# EAGLE design dBreathe (EAGLE 6.3)
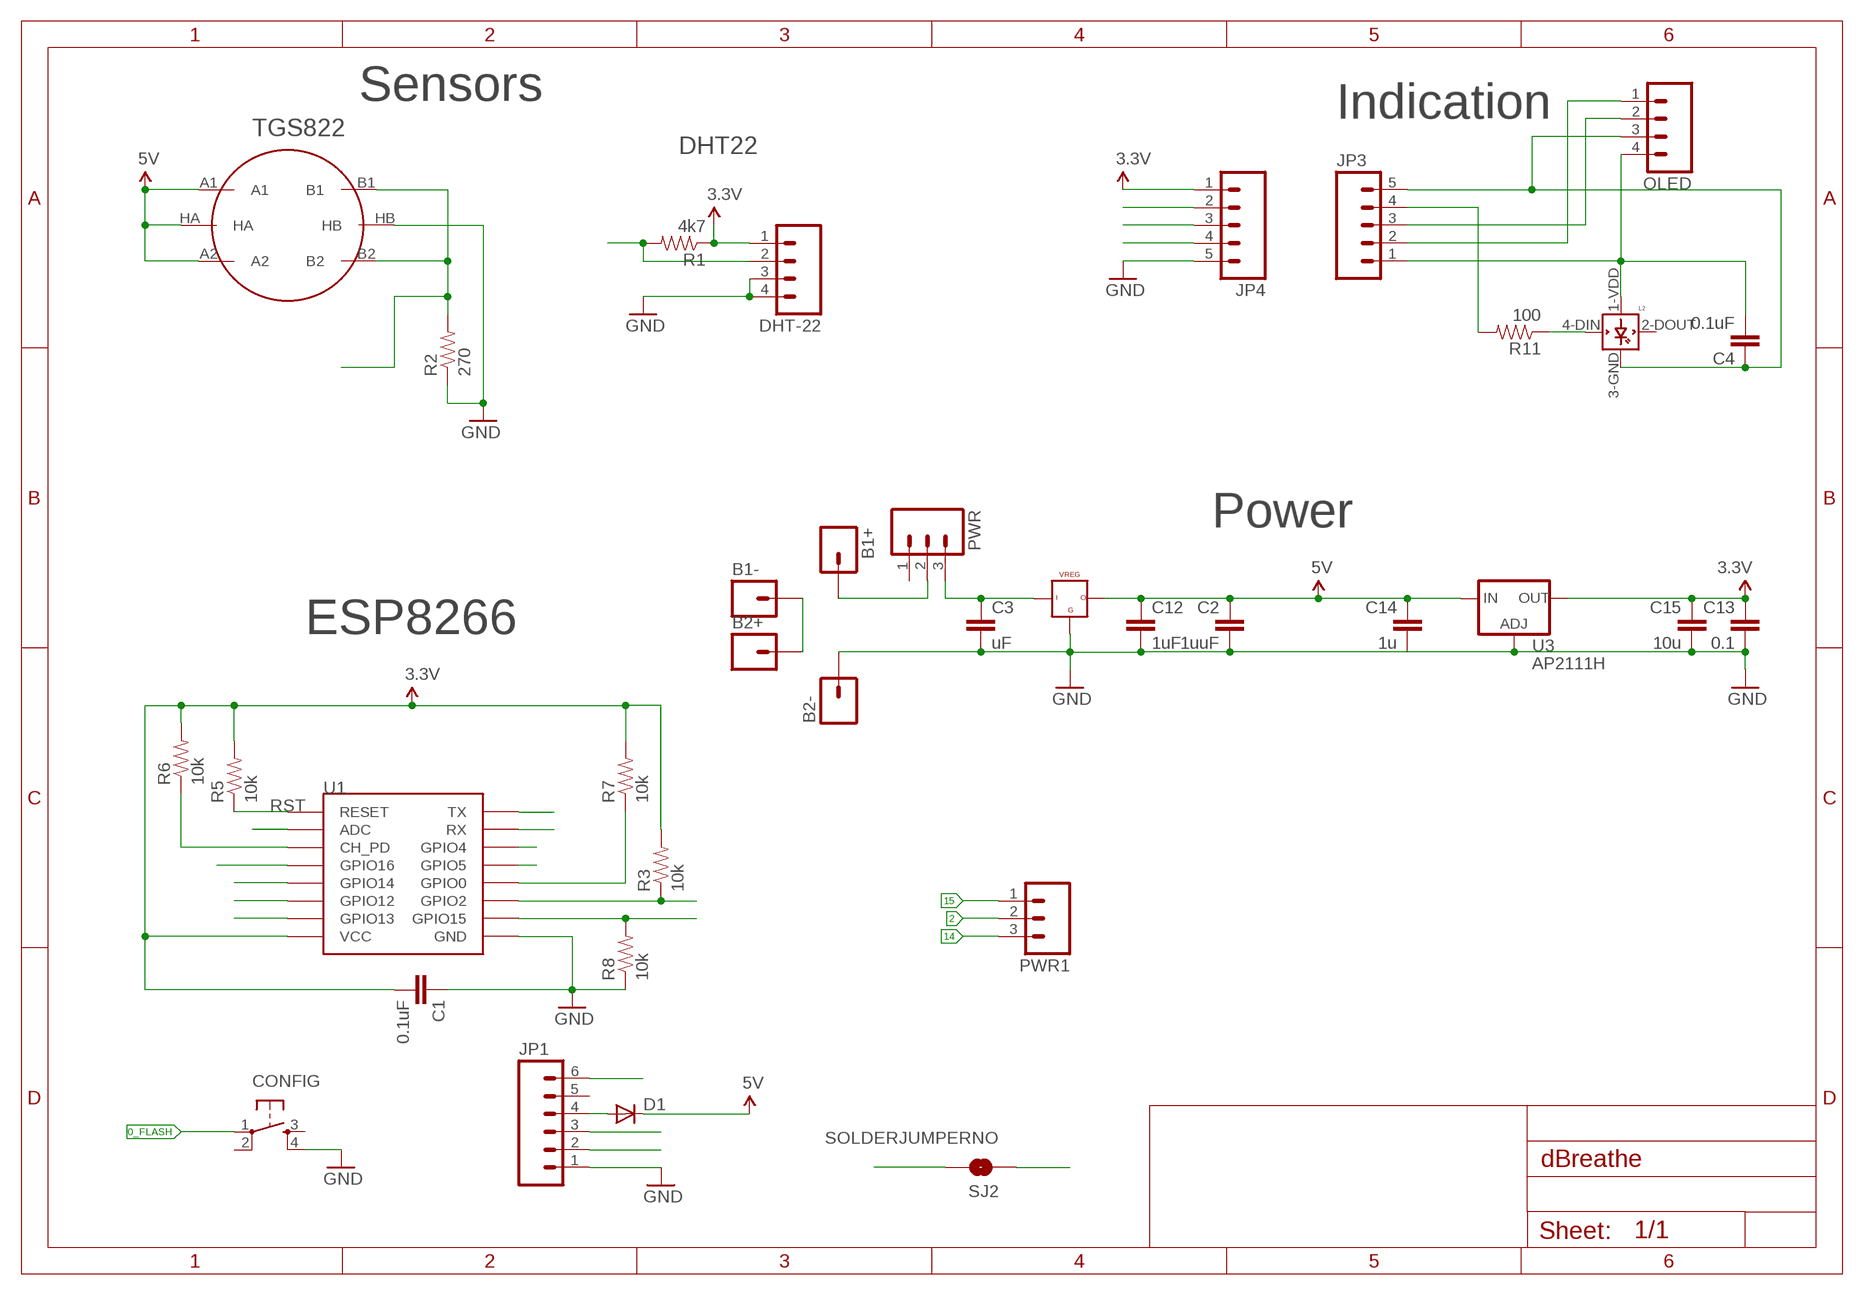
[diagram p0: schematic, sheet 1]

## Parts
B1+  M01PTH  [1X01]
B1-  M01PTH  [1X01]
B2+  M01PTH  [1X01]
B2-  M01PTH  [1X01]
C1  0.1uF  CAP0805  [0805]
C2  1uuF  CAP0805  [0805]
C3  uF  CAP0805  [0805]
C4  0.1uF  CAP0805  [0805]
C12  1uF  CAP0805  [0805]
C13  0.1  CAP0805  [0805]
C14  1u  CAP0805  [0805]
C15  10u  CAP0805-CAP  [0805-CAP]
CONFIG  TAC_SWITCHSMD  [TACTILE_SWITCH_SMD]
D1  DIODESOD  [SOD-323]
DHT-22  M04PTH  [1X04]
JP1  M06NO_SILK_FEMALE_PTH  [1X06_NO_SILK]
JP3  M05PTH  [1X05]
JP4  M05PTH  [1X05]
L2  WS2812B  [WS2812B]
OLED  M041X04_NO_SILK  [1X04_NO_SILK]
PWR  M03PTH  [1X03]
PWR1  M03PTH  [1X03]
R1  4k7  RESISTOR0805-RES  [0805]
R2  270  RESISTOR0805  [0805]
R3  10k  RESISTOR0805  [0805]
R5  10k  RESISTOR0805  [0805]
R6  10k  RESISTOR0805  [0805]
R7  10k  RESISTOR0805  [0805]
R8  10k  RESISTOR0805  [0805]
R11  100  RESISTOR0805  [0805]
SJ2  SOLDERJUMPERNO  [SJ_2S-NO]
U1  ESP12SMD  [ESP12-SMD]
U3  AP2111H  V_REG_317SMD  [SOT223]
U$4  VREG_5V  [DPACK]
U$7  METHANE_SENSOR  [MQ-3]

## Nets
0_FLASH: CONFIG.1 JP1.6 R7.1 U1.GPIO0
2: PWR1.2 R3.1 U1.GPIO2
3.3V: C1.2 C13.1 C15.1 DHT-22.1 JP4.1 R1.1 R3.2 R5.2 R6.2 R7.2 U1.VCC U3.2(OUT)
3V3_1: C4.2 JP3.1 L2.1-VDD(VDD) OLED.4
4_SDA: JP4.2 U1.GPIO5
4_SDA_1: JP3.2 OLED.1
5_SCL: JP4.3 U1.GPIO4
5_SCL_1: JP3.3 OLED.2
5V: C2.1 C12.1 C14.1 D1.1(C) U3.3(IN) U$4.3 U$7.A1 U$7.A2 U$7.HA
12_WS2812: JP4.4 U1.GPIO12
12_WS2812_1: JP3.4 R11.2
13_DHT: DHT-22.2 R1.2 U1.GPIO13
14: PWR1.3 U1.GPIO14
15: PWR1.1 R8.2 U1.GPIO15
16_DSLEEP: SJ2.2 U1.GPIO16
ADC: R2.2 U1.ADC U$7.B1 U$7.B2
CH_PD: R6.1 U1.CH_PD
GND: B2-.1 C1.1 C2.2 C3.2 C12.2 C13.2 C14.2 C15.2 CONFIG.4 DHT-22.3 DHT-22.4 JP1.1 JP4.5 R2.1 R8.1 U1.GND U3.1(ADJ) U$4.2 U$7.HB
GND_1: C4.1 JP3.5 L2.3-GND(GND) OLED.3
N$1: D1.2(A) JP1.4
N$2: B1+.1 PWR.2
N$5: L2.4-DIN(DIN) R11.1
N$6: B1-.1 B2+.1
RST: R5.1 SJ2.1 U1.RESET
RX: JP1.2 U1.TXD0(TX)
TX: JP1.3 U1.RXD0(RX)
VCC: C3.1 PWR.3 U$4.1
Unconnected: CONFIG.2 CONFIG.3 JP1.5 L2.2-DOUT(DOUT) PWR.1

## Notes on the sheet
- Sensors
- Indication
- TGS822
- DHT22
- Power
- ESP8266

## Library data of the parts
B1+ B1- B2+ B2- = SparkFun-Connectors:M01: Header 1 Standard 1-pin 0.1" header. Use with straight break away headers (SKU : PRT-00116), right angle break away headers (PRT-00553), swiss pins (PRT-00743), machine pins (PRT-00117), and female headers (PRT-00115).
C1 C3 C4 C12 = SparkFun-Capacitors:CAP: Capacitor Standard 0603 ceramic capacitor, and 0.1" leaded capacitor.
C2 C13-C15 = LowPowerLab:CAP: Capacitor Standard 0603 ceramic capacitor, and 0.1" leaded capacitor.
CONFIG = SparkFun-Electromechanical:TAC_SWITCH: Momentary Switch Button commonly used for reset or general input. Spark Fun Electronics SKU : COM-00097 SMT- SWCH-08247; PROD_ID: SWCH-08247
D1 = SparkFun-DiscreteSemi:DIODE: Diode These are standard reverse protection diodes and small signal diodes. SMA package can handle up to about 1A. SOD-323 can handle about 200mA. What the SOD-323 package when ordering, there are some mfgs out there that are 5-pin packages.
DHT-22 OLED = SparkFun-Connectors:M04: Header 4 Standard 4-pin 0.1" header. Use with straight break away headers (SKU : PRT-00116), right angle break away headers (PRT-00553), swiss pins (PRT-00743), machine pins (PRT-00117), and female headers (PRT-00115). Molex polarized connector foot print use with SKU : PRT-08231 with associated crimp pins and housings. 1MM SMD Version SKU: PRT-10208
JP1 = SparkFun-Connectors:M06: Header 6 Standard 6-pin 0.1" header. Use with straight break away headers (SKU : PRT-00116), right angle break away headers (PRT-00553), swiss pins (PRT-00743), machine pins (PRT-00117), and female headers (PRT-00115). Molex polarized connector foot print use with SKU : PRT-08094 with associated crimp pins and housings. NOTES ON THE VARIANTS LOCK and LOCK_LONGPADS... This footprint was designed to help hold the alignment of a through-hole component (i.e. 6-pin header) while soldering it into place. You may notice that each hole has been shifted either up or down by 0.005 of an inch from it's more standard position (which is a perfectly straight line). This slight alteration caused the pins (the squares in the middle) to touch the edges of the holes. Because they are alternating, it causes a "brace" to hold the component in place. 0.005 has proven to be the perfect amount of "off-center" position when using our standard breakaway headers. Although looks a little odd when you look at the bare footprint, once you have a header in there, the alteration is very hard to notice. Also,if you push a header all the way into place, it is covered up entirely on the bottom side. This idea of altering the position of holes to aid alignment will be further integrated into the Sparkfun Library for other footprints. It can help hold any component with 3 or more connection pins.; PROD_ID: CONN-08437
JP3 JP4 = SparkFun-Connectors:M05: Header 5 Standard 5-pin 0.1" header. Use with straight break away headers (SKU : PRT-00116), right angle break away headers (PRT-00553), swiss pins (PRT-00743), machine pins (PRT-00117), and female headers (PRT-00115). Molex polarized connector foot print use with SKU : PRT-08230 with associated crimp pins and housings.
L2 = adafruit:WS2812B
PWR PWR1 = SparkFun-Connectors:M03: Header 3 Standard 3-pin 0.1" header. Use with straight break away headers (SKU : PRT-00116), right angle break away headers (PRT-00553), swiss pins (PRT-00743), machine pins (PRT-00117), and female headers (PRT-00115). Molex polarized connector foot print use with SKU : PRT-08232 with associated crimp pins and housings.
R1 = SparkFun-Resistors:RESISTOR: Resistor Basic schematic elements and footprints for 0603, 1206, and PTH resistors.
R2 R3 R5-R8 R11 = LowPowerLab:RESISTOR: Resistor Basic schematic elements and footprints for 0603, 1206, and PTH resistors.
SJ2 = SparkFun-Passives:SOLDERJUMPER: Solder Jumper Standard SMD solder jumper. Used to automate production. Two varients : Normally Open and Normally Closed are the same, but have different paste layers. NC will have a large amount of paste and should jumper during reflow.
U1 = esp8266modules:ESP12: ESP8266 Wifi module 12
U3 = 11xSKIPS:V_REG_317: Voltage Regulator AP2111 3v3 Regulator SOT223 600mA
U$4 = 11xSKIPS:VREG_5V
U$7 = SparkFun-Sensors:METHANE_SENSOR: MQ-4 Methane Gas Sensor SEN-09404

## Net classes
1 power: width 0.381 mm, clearance 0.254 mm

## Board
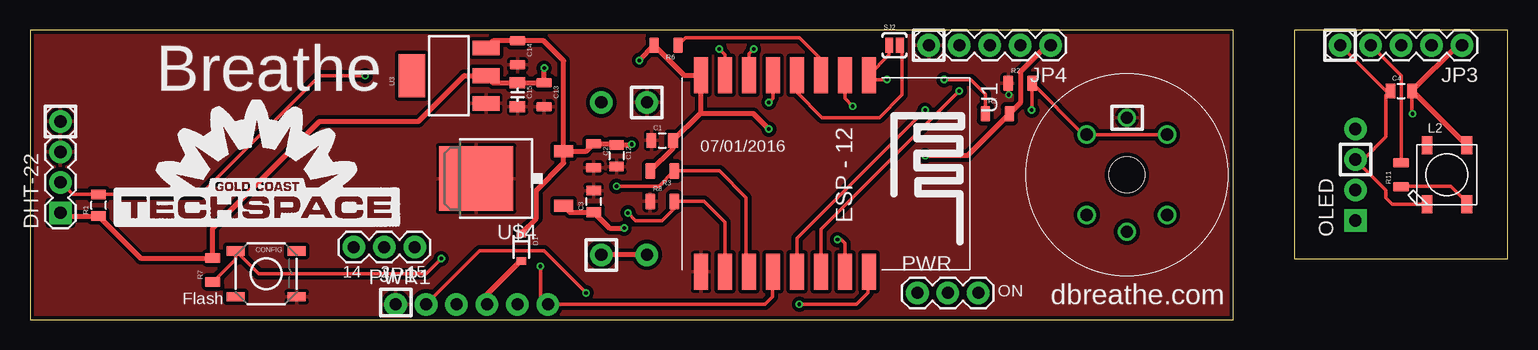
[diagram p1: board, top side]
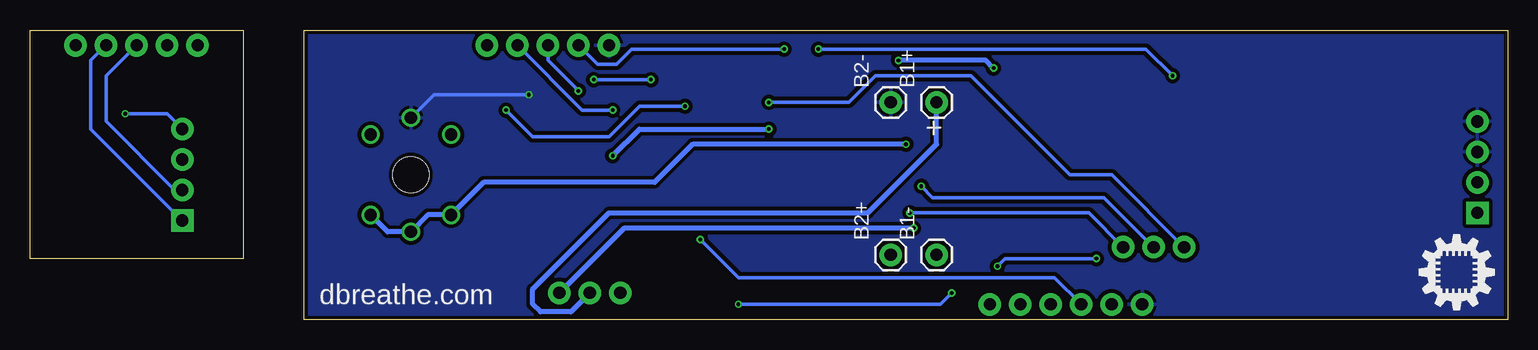
[diagram p2: board, bottom side, seen from below]

Size 123.19 x 24.13 mm. Coordinates in mm from the lower left corner, seen from the top.
Outline: 0,0 100.33,0 100.33,24.13 0,24.13 0,0
Outline: 105.41,24.13 105.41,5.08 123.19,5.08 123.19,24.13 105.41,24.13
Copper layers (1*16): Top 0.035mm / dielectric 1.5mm / Bottom 0.035mm
Design rules "dirt_cheap_dirty_boards.v1": minimum track width 5mil, minimum drill 12mil, track to track 5mil, track to pad 5mil, pad to pad 5mil, via to via 5mil, smd to smd 0mil, copper to edge 10mil, drill to drill 10mil, minimum pad ring 10mil, minimum via ring 6mil, stop-mask expansion 2mil, vias tented up to drill 25mil, thermal gap 10mil

### Footprints (pad centres in the part's own frame; a part is rotated, then mirrored left to right if it is on the bottom)
1X01 = drill 1.016 pad 1.88: 1 0,0
0805 = smd 0.8 x 1.2: 1 -0.9,0; 2 0.9,0
0805' = smd 0.8 x 1.3: 1 -1,0; 2 1,0
0805-CAP = smd 0.902 x 1.3: 1 -1,0; 2 1,0
TACTILE_SWITCH_SMD = smd 1.524 x 0.762: 1 -2.54,1.905; 2 2.54,1.905; 3 -2.54,-1.905; 4 2.54,-1.905
SOD-323 = smd 0.63 x 0.83: 1 -1.15,0; 2 1.15,0
1X04 = drill 1.016 pad 1.88 square: 1 0,0 | drill 1.016 pad 1.88: 2 2.54,0; 3 5.08,0; 4 7.62,0
1X06_NO_SILK = drill 1.016 pad 1.88: 1 0,0; 2 2.54,0; 3 5.08,0; 4 7.62,0; 5 10.16,0; 6 12.7,0
1X05 = drill 1.016 pad 1.88: 1 0,0; 2 2.54,0; 3 5.08,0; 4 7.62,0; 5 10.16,0
WS2812B = smd 1.5 x 0.9: 1-VDD 2.45,-1.65; 2-DOUT 2.45,1.65; 3-GND -2.45,1.65; 4-DIN -2.45,-1.65
1X04_NO_SILK = drill 1.016 pad 1.88 square: 1 0,0 | drill 1.016 pad 1.88: 2 2.54,0; 3 5.08,0; 4 7.62,0
1X03 = drill 1.016 pad 1.88: 1 0,0; 2 2.54,0; 3 5.08,0
SJ_2S-NO = smd 0.635 x 1.27: 1 -0.45,0; 2 0.45,0
ESP12-SMD = smd 3 x 1.2: ADC -8.3,3.8; CH_PD -8.3,1.8; GND 8.1,-8.2; GPIO0 8.1,-2.2; GPIO2 8.1,-4.2; GPIO4 8.1,1.8; GPIO5 8.1,-0.2; GPIO12 -8.3,-4.2; GPIO13 -8.3,-6.2; GPIO14 -8.3,-2.2; GPIO15 8.1,-6.2; GPIO16 -8.3,-0.2; RESET -8.3,5.8; RXD0 8.1,3.8; TXD0 8.1,5.8; VCC -8.3,-8.2
SOT223 = smd 1.219 x 2.235: 1 -2.311,-3.099; 2 0,-3.099; 3 2.311,-3.099 | smd 3.6 x 2.2: 4 0,3.099
DPACK = smd 1 x 1.6: 1 -2.28,-4.8; 3 2.28,-4.8 | smd 5.4 x 6.2: 2 0,2.5
MQ-3 = drill 1.016: A1 -3.35,3.35; A2 -3.35,-3.35; B1 3.35,3.35; B2 3.35,-3.35; HA -4.75,0; HB 4.75,0 | hole 3: 0,0

### Placement (x,y rotation side)
B1+  47.62,18.1 90 bottom
B1-  47.62,5.4 90 bottom
B2+  51.44,5.4 90 bottom
B2-  51.44,18.1 90 bottom
C1  52.7,14.92 0 top
C2  1uuF  [0805']  46.99,13.65 270 top
C3  46.99,9.84 90 top
C4  114.3,19.05 0 top
C12  48.9,13.65 270 top
C13  0.1  [0805']  42.86,18.73 270 top
C14  1u  [0805']  40.64,22.23 270 top
C15  40.64,18.73 270 top
CONFIG  19.68,3.81 0 top
D1  40.96,6.03 270 top
DHT-22  2.54,8.89 90 top
JP1  30.48,1.27 0 top
JP3  119.38,22.86 180 top
JP4  85.09,22.86 180 top
L2  118.11,12.06 90 top
OLED  110.49,8.26 90 top
PWR  73.98,2.22 0 top
PWR1  32.07,6.03 180 top
R1  5.71,9.53 90 top
R2  270  [0805']  82.55,19.68 0 top
R3  10k  [0805']  52.7,12.38 180 top
R5  10k  [0805']  80.64,17.14 0 top
R6  10k  [0805']  53.02,22.86 180 top
R7  10k  [0805']  15.24,4.13 90 top
R8  10k  [0805']  52.7,9.84 0 top
R11  100  [0805']  114.3,12.06 90 top
SJ2  72.07,22.86 0 top
U1  64.14,12.06 270 top
U3  34.92,20.32 90 top
U$1  [GCTS_X0.5_TSILK]  6.99,7.62 0 top
U$4  39.69,11.75 90 top
U$7  91.44,12.06 90 top
U$15  [ID_LOGO_X0.25]  7.49,0.67 0 bottom

### Tracks (layer width: path | path; a pad name or v marks a point on that pad's centre or on a via)
0_FLASH  (via drill 0.3)
  Top 0.305: U1.GPIO0 61.91,3.94 61.91,1.91 61.28,1.27 JP1.6 42.55,1.91 v42.55,4.45 | R7.1 17.14,5.03 CONFIG.1 19.05,3.81 33.02,3.81 v34.29,5.08
  Bottom 0.305: v42.55,4.45 41.91,5.08 v34.29,5.08
2  (via drill 0.3)
  Top 0.305: U1.GPIO2 59.69,3.96 59.69,10.16 57.47,12.38 R3.1 52.44,11.11 v48.9,11.11
  Bottom 0.305: v48.9,11.11 47.94,10.16 33.66,10.16 PWR1.2
3.3V  (via drill 0.3)
  Top 0.305: JP4.1 84.77,22.86
  Top 0.406: DHT-22.1 2.81,8.62 R1.1 9.21,5.13 R7.2 15.24,7.62 24.13,16.51 32.38,16.51 36.2,20.32 U3.2 38.61,19.73 C15.1 C13.1 v42.86,20.95 | v50.8,21.59 R6.2 54.52,20.36 U1.VCC 55.94,17.25 55.85,17.17 | 55.85,17.17 C1.2 53.6,14.28 R3.2 | 84.77,22.86 82.55,20.64 82.55,18.05 R5.2 78.15,13.65 v74.61,13.65 | v61.59,15.88 60.3,17.17 55.85,17.17
  Bottom 0.406: v42.86,20.95 43.5,21.59 v50.8,21.59 | v74.61,13.65 72.39,15.88 v61.59,15.88
3V3_1  (via drill 0.3)
  Top 0.305: v115.25,17.14 115.2,17.2 C4.2
  Top 0.406: JP3.1 119.01,22.86 C4.2 115.22,19.05 L2.1-VDD
  Bottom 0.305: OLED.4 111.76,17.14 v115.25,17.14
4_SDA  (via drill 0.3)
  Top 0.305: U1.GPIO5 63.94,6.79 v74.61,17.46
  Bottom 0.305: v74.61,17.46 77.15,17.46 JP4.2
4_SDA_1
  Bottom 0.305: OLED.1 118.11,15.88 118.11,21.59 JP3.2
5_SCL  (via drill 0.3)
  Top 0.305: v77.47,19.05 65.94,7.51 U1.GPIO4
  Bottom 0.305: JP4.3 80.01,21.59 v77.47,19.05
5_SCL_1
  Bottom 0.305: OLED.2 111.12,10.79 116.84,16.51 116.84,20.32 JP3.3
5V  (via drill 0.3)
  Top 0.406: U$4.3 46.37,14.03 C2.1 48.8,14.65 C12.1 50.11,14.55 v50.16,14.61 | U$4.3 44.49,21.55 42.81,23.23 C14.1 38.62,23.23 U3.3 | D1.1 42.23,8.45 42.23,10.79 44.49,13.05 U$4.3
  Bottom 0.406: v50.16,14.61 67.94,14.61 71.12,11.43 85.38,11.43 U$7.A1 90.04,8.71 U$7.HA 93.39,7.32 U$7.A2
12_WS2812  (via drill 0.3)
  Top 0.305: U1.GPIO12 59.94,22.15 v60.33,22.54
  Bottom 0.305: v60.33,22.54 73.03,22.54 74.3,21.27 75.88,21.27 JP4.4
12_WS2812_1
  Top 0.305: JP3.4 114.3,20.32 R11.2
13_DHT  (via drill 0.3)
  Top 0.305: DHT-22.2 3.54,10.43 R1.2 14.23,10.43 24.13,20.32 v27.94,20.32 | v57.47,22.54 57.94,22.07 U1.GPIO13
  Bottom 0.305: v27.94,20.32 30.16,22.54 v57.47,22.54
14  (via drill 0.3)
  Top 0.305: U1.GPIO14 61.94,18.44 v61.59,18.1
  Bottom 0.305: v61.59,18.1 54.93,18.1 52.7,20.32 44.77,20.32 36.51,12.06 33.02,12.06 PWR1.3
15  (via drill 0.3)
  Top 0.305: U1.GPIO15 57.94,8.11 56.2,9.84 R8.2 53.7,9.26 52.7,8.26 50.48,8.26 v49.85,8.89
  Bottom 0.305: v49.85,8.89 34.92,8.89 PWR1.1
16_DSLEEP
  Top 0.305: SJ2.2 72.71,22.68 72.71,18.73 70.8,16.83 66.04,16.83 63.94,18.93 U1.GPIO16
ADC  (via drill 0.3)
  Top 0.305: U$7.B2 U$7.B1 87.82,15.41 R2.2 83.5,19.64 v83.5,17.46 | U1.ADC 67.94,18.43 v68.58,17.78
  Bottom 0.305: v68.58,17.78 72.39,17.78 74.93,15.24 81.28,15.24 v83.5,17.46
CH_PD
  Top 0.305: U1.CH_PD 65.94,21.7 64.14,23.5 54.66,23.5 R6.1
GND  (via drill 0.3)
  Top 0.305: R2.1 81.55,18.78 v81.6,18.73
  Bottom 0.305: v81.6,18.73 89.52,18.73 U$7.HB
  pour Top (isolate 0.32): 0,24.13 100.33,24.13 100.33,0 0,0
  pour Bottom (isolate 0.32): 0,24.13 100.33,24.13 100.33,0 0,0
GND_1
  Top 0.305: L2.3-GND 113.58,9.62 113.03,10.16 113.03,10.79 OLED.3 111.12,13.34 113.03,15.24 113.03,18.68 C4.1 113.03,19.05 JP3.5
N$1
  Top 0.406: JP1.4 38.1,2.1 40.88,4.88 D1.2
N$2
  Bottom 0.406: PWR.2 78.11,0.64 80.64,0.64 81.28,1.27 81.28,2.54 74.93,8.89 53.34,8.89 47.62,14.61 B1+.1
N$5
  Top 0.305: R11.1 114.35,11.11 118.43,11.11 119.76,9.78 L2.4-DIN
N$6
  Top 0.406: B2+.1 B1-.1
RST  (via drill 0.3)
  Top 0.305: SJ2.1 71.62,22.05 U1.RESET 70.3,20 v71.44,20 | R5.1 79.64,18.78 78.42,20 v76.2,20
  Bottom 0.305: v76.2,20 v71.44,20
RX  (via drill 0.3)
  Top 0.305: U1.TXD0 69.85,3.88 69.85,2.22 68.9,1.27 v64.14,1.27 | v46.35,2.22 42.86,5.71 37.47,5.71 JP1.2
  Bottom 0.305: v64.14,1.27 47.31,1.27 v46.35,2.22
TX  (via drill 0.3)
  Top 0.305: U1.RXD0 67.94,3.98 67.94,6.35 67.63,6.67 v67.31,6.67
  Bottom 0.305: v67.31,6.67 64.14,3.49 37.78,3.49 JP1.3
VCC  (via drill 0.3)
  Top 0.406: U$4.1 45.01,8.94 C3.1 48.31,7.62 v49.53,7.62
  Bottom 0.406: v49.53,7.62 73.66,7.62 PWR.3

### Text on the board
tPlace: Breathe | 07/01/2016 | 14 | 2 | 15 | ON | Flash | dbreathe.com
bPlace: + | dbreathe.com
tStop: d
tDocu: REG | REG
_bsilk: VIN | 3.3 | 1 | 0 | A7 | A6 | A5 | A4 | A3 | A2 | A1 | A0 | GND | ANT | DTR | GND | 3.3 | + | AREF | GND | 2 | 3 | 4 | 5 | 6 | 7 | 8 | 9 | 10 | 11 | 12 | 13 | RST | VIN | 3.3 | 1 | 0 | A7 | A6 | A5 | A4 | A3 | A2 | A1 | A0 | GND | ANT | DTR | GND | 3.3 | + | AREF | GND | 2 | 3 | 4 | 5 | 6 | 7 | 8 | 9 | 10 | 11 | 12 | 13 | RST